# Altium schematic sheet DX-LR20&30_SCH_Part_AD.SchDoc
size A4
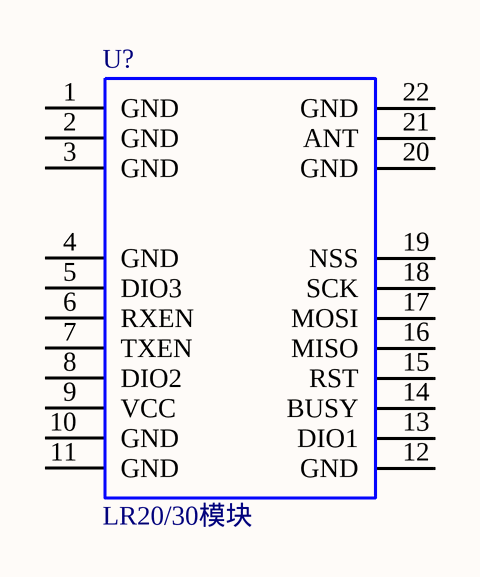
[diagram p0: DX-LR20&30_SCH_Part_AD.SchDoc]

## Parts
U?  LR20/30模块  [PE220-400M22S]

## Nets

Not connected (* = marked no-connect by the designer): U? 1(GND) 2(GND) 3(GND) 4(GND) 5(DIO3) 6(RXEN) 7(TXEN) 8(DIO2) 9(VCC) 10(GND) 11(GND) 12(GND) 13(DIO1) 14(BUSY) 15(RST) 16(MISO) 17(MOSI) 18(SCK) 19(NSS) 20(GND) 21(ANT) 22(GND)